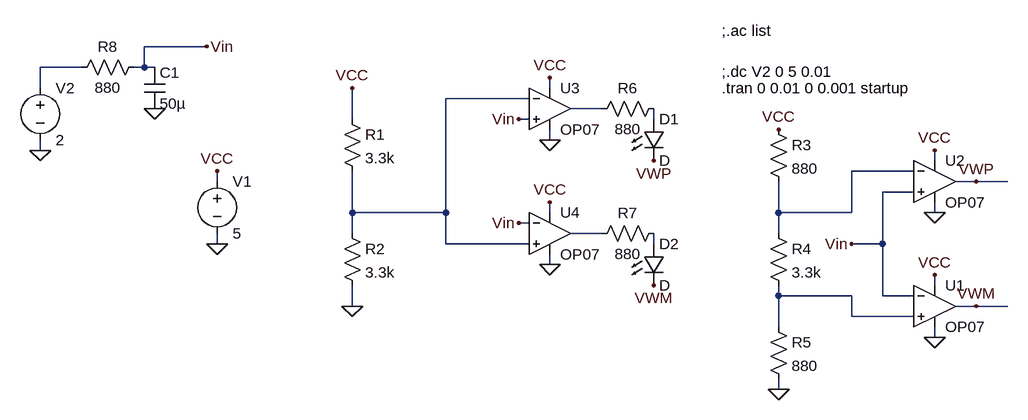
[diagram p0: schematic led_circuit.asc]
led_circuit.asc, the LTspice schematic file:
Version 4.1
SHEET 1 1248 680
WIRE -208 -128 -304 -128
WIRE -400 -96 -464 -96
WIRE -304 -96 -304 -128
WIRE -304 -96 -320 -96
WIRE -288 -96 -304 -96
WIRE -464 -64 -464 -96
WIRE 320 -64 320 -80
WIRE 288 -48 160 -48
WIRE 400 -32 352 -32
WIRE 16 -16 16 -64
WIRE 288 -16 272 -16
WIRE 480 -16 480 -32
WIRE 320 16 320 0
WIRE -464 32 -464 16
WIRE 912 48 912 32
WIRE 880 64 784 64
WIRE -192 80 -192 64
WIRE 976 80 944 80
WIRE 1024 80 976 80
WIRE 880 96 832 96
WIRE 16 128 16 64
WIRE 160 128 160 -48
WIRE 160 128 16 128
WIRE 320 128 320 112
WIRE 672 128 672 80
WIRE 784 128 784 64
WIRE 784 128 672 128
WIRE 912 128 912 112
WIRE 288 144 272 144
WIRE 16 160 16 128
WIRE 400 160 352 160
WIRE 672 160 672 128
WIRE -192 176 -192 160
WIRE 160 176 160 128
WIRE 288 176 160 176
WIRE 480 176 480 160
WIRE 832 176 832 96
WIRE 832 176 784 176
WIRE 320 208 320 192
WIRE 912 240 912 224
WIRE 672 256 672 240
WIRE 784 256 672 256
WIRE 832 256 832 176
WIRE 880 256 832 256
WIRE 16 272 16 240
WIRE 976 272 944 272
WIRE 1024 272 976 272
WIRE 784 288 784 256
WIRE 880 288 784 288
WIRE 672 304 672 256
WIRE 912 320 912 304
WIRE 672 400 672 384
FLAG 320 208 0
FLAG -192 176 0
FLAG -192 64 VCC
FLAG 320 112 VCC
FLAG -464 32 0
FLAG -208 -128 Vin
FLAG 272 144 Vin
FLAG 16 -64 VCC
FLAG 16 272 0
FLAG 320 16 0
FLAG 320 -80 VCC
FLAG 272 -16 Vin
FLAG 912 320 0
FLAG 912 224 VCC
FLAG 672 400 0
FLAG 672 0 VCC
FLAG 912 128 0
FLAG 912 32 VCC
FLAG 784 176 Vin
FLAG 976 80 VWP
FLAG 976 272 VWM
FLAG 480 48 VWP
FLAG 480 240 VWM
FLAG -288 -32 0
SYMBOL voltage -192 64 R0
WINDOW 123 0 0 Left 0
WINDOW 39 0 0 Left 0
SYMATTR InstName V1
SYMATTR Value 5
SYMBOL voltage -464 -80 R0
WINDOW 123 0 0 Left 0
WINDOW 39 0 0 Left 0
SYMATTR InstName V2
SYMATTR Value 2
SYMBOL res 0 -32 R0
SYMATTR InstName R1
SYMATTR Value 3.3k
SYMBOL res 0 144 R0
SYMATTR InstName R2
SYMATTR Value 3.3k
SYMBOL OpAmps\\OP07 320 -96 R0
SYMATTR InstName U3
SYMBOL OpAmps\\OP07 320 96 R0
SYMATTR InstName U4
SYMBOL OpAmps\\OP07 912 208 R0
SYMATTR InstName U1
SYMBOL res 656 -16 R0
SYMATTR InstName R3
SYMATTR Value 880
SYMBOL res 656 144 R0
SYMATTR InstName R4
SYMATTR Value 3.3k
SYMBOL res 656 288 R0
SYMATTR InstName R5
SYMATTR Value 880
SYMBOL OpAmps\\OP07 912 16 R0
SYMATTR InstName U2
SYMBOL LED 464 -16 R0
SYMATTR InstName D1
SYMBOL LED 464 176 R0
SYMATTR InstName D2
SYMBOL res 496 -48 R90
WINDOW 0 0 56 VBottom 2
WINDOW 3 32 56 VTop 2
SYMATTR InstName R6
SYMATTR Value 880
SYMBOL res 496 144 R90
WINDOW 0 0 56 VBottom 2
WINDOW 3 32 56 VTop 2
SYMATTR InstName R7
SYMATTR Value 880
SYMBOL cap -304 -96 R0
SYMATTR InstName C1
SYMATTR Value 50µ
SYMBOL res -304 -112 R90
WINDOW 0 0 56 VBottom 2
WINDOW 3 32 56 VTop 2
SYMATTR InstName R8
SYMATTR Value 880
TEXT 584 -152 Left 2 !;.ac list\n\n;.dc V2 0 5 0.01
TEXT 584 -64 Left 2 !.tran 0 0.01 0 0.001 startup

The netlist it stands for:
* led_circuit.asc
V1 VCC 0 5
V2 N001 0 2
R1 VCC N002 3.3k
R2 N002 0 3.3k
X§U3 Vin N002 VCC 0 N003 LT1001  ; OP07, pins In+ In- V+ V- OUT
X§U4 N002 Vin VCC 0 N006 LT1001  ; OP07, pins In+ In- V+ V- OUT
X§U1 N008 Vin VCC 0 VWM LT1001  ; OP07, pins In+ In- V+ V- OUT
R3 VCC N005 880
R4 N005 N008 3.3k
R5 N008 0 880
X§U2 Vin N005 VCC 0 VWP LT1001  ; OP07, pins In+ In- V+ V- OUT
D1 N004 VWP D
D2 N007 VWM D
R6 N004 N003 880
R7 N007 N006 880
C1 Vin 0 50µ
R8 Vin N001 880
.model D D
.lib standard.dio
;.ac list
;.dc V2 0 5 0.01
.tran 0 0.01 0 0.001 startup
.lib LTC.lib
.backanno
.end